# EAGLE design E19_mini (EAGLE 9.3.0)
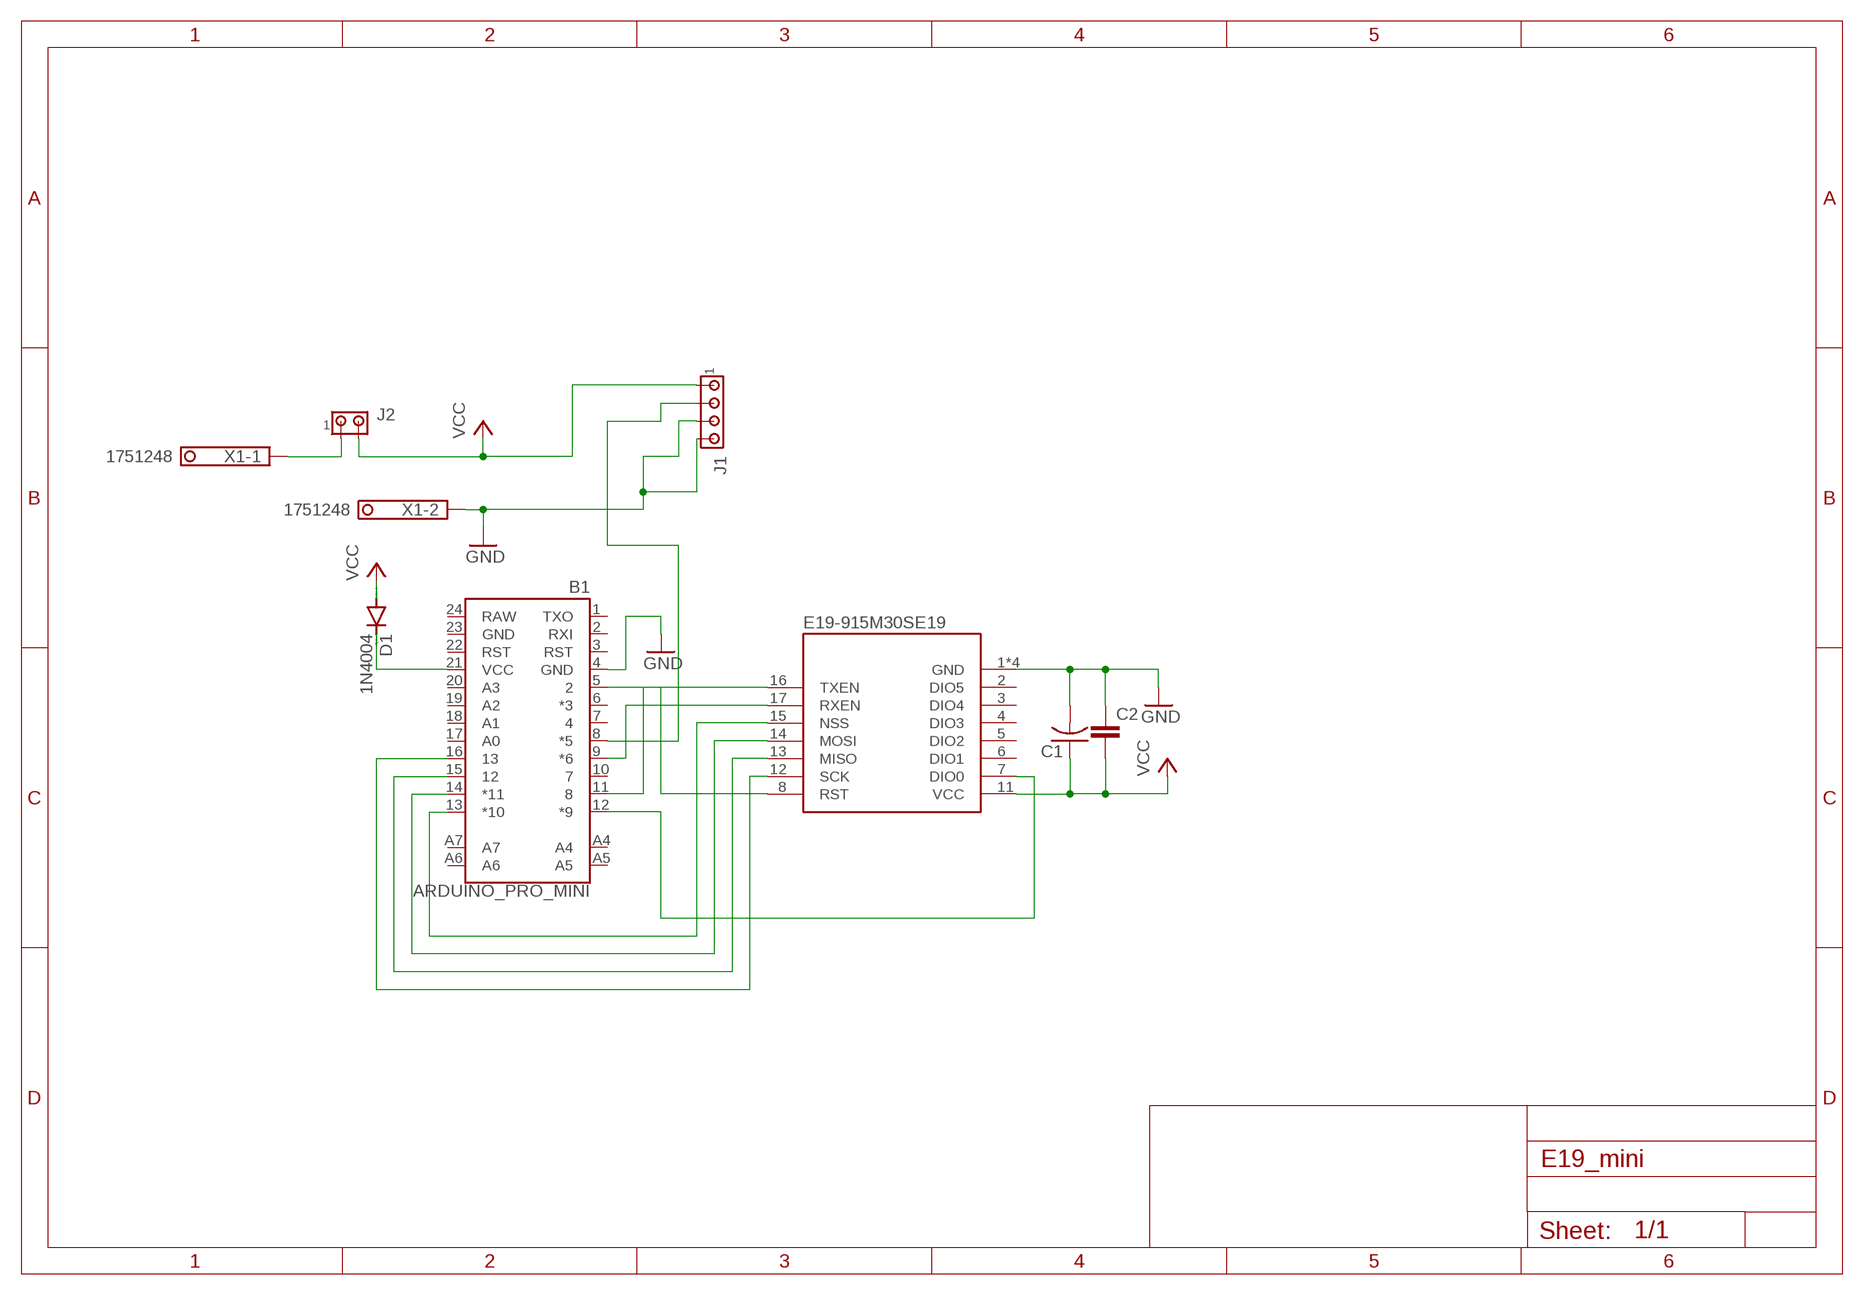
[diagram p0: schematic, sheet 1]

## Parts
B1  ARDUINO_PRO_MINI  [ARDUINO_PRO_MINI]
C1  C-US050-024X044  [C050-024X044]
C2  C-EU025-024X044  [C025-024X044]
D1  1N4004  [DO41-10]
J1  MTA04-100  [10X04MTA]
J2  MTA02-100  [10X02MTA]
U1  E19-915M30SE19  [DIP2540W53P254L2400H508Q18B]
X1  1751248  [1751248]

## Nets
GND: B1.4(GND) C1.2 C2.1 J1.3 J1.4 U1.1(GND) U1.9(GND) U1.10(GND) U1.18(GND) X1.2
N$1: B1.5 U1.8(RST)
N$2: B1.16 U1.12(SCK)
N$3: B1.15 U1.13(MISO)
N$4: B1.14(*11) U1.14(MOSI)
N$5: B1.13(*10) U1.15(NSS)
N$6: B1.11 U1.16(TXEN)
N$7: B1.9(*6) U1.17(RXEN)
N$8: B1.21(VCC) D1.C
N$9: J2.1 X1.1
N$10: B1.12(*9) U1.7(DIO0)
N$11: B1.8(*5) J1.2
VCC: C1.1 C2.2 D1.A J1.1 J2.2 U1.11(VCC)
Unconnected: B1.1(TXO) B1.2(RXI) B1.3(RST) B1.6(*3) B1.7 B1.10 B1.17(A0) B1.18(A1) B1.19(A2) B1.20(A3) B1.22(RST) B1.A4 B1.A5 B1.A6 B1.A7 U1.2(DIO5) U1.3(DIO4) U1.4(DIO3) U1.5(DIO2) U1.6(DIO1)

## Power pins joined to a net without a drawn wire
GND: B1.23(GND)
RAW: B1.24(RAW)

## Library data of the parts
B1 = ARDUINO_PRO_MINI:ARDUINO_PRO_MINI: SparkFun Pro Mini Pro Mini compatible footprint. Dimensions: 0.7 x 1.3" PCB Thickness: 0.8mm SparkFun Products: 3.3V/8MHz <https://www.sparkfun.com/products/11114> 5V/16MHz <https://www.sparkfun.com/products/11113>; AVAILABILITY: Unavailable; DESCRIPTION: ATmega328 Arduino Pro Mini 328 5V/16MHz AVR® ATmega AVR MCU 8-Bit Embedded Evaluation Board; MF: SparkFun Electronics; MP: ARDUINO PRO MINI; PACKAGE: Package Analog Devices; PRICE: None
C1 = rcl:C-US: CAPACITOR, American symbol; SPICEPREFIX: C
C2 = rcl:C-EU: CAPACITOR, European symbol; SPICEPREFIX: C
D1 = diode:1N4004: DIODE general purpose rectifier, 1 A
J1 = con-amp:MTA04-100: AMP connector
J2 = con-amp:MTA02-100: AMP connector
U1 = E22-900T30S:E19-915M30S: E22-900T30S is a wireless serial port module (UART) based on SEMTECH's SX1262 RF chip.
X1 = con-phoenix-350:1751248: MKDS 1/ 2-3,5 Printklemme Nennstrom: 10 A Bemessungsspannung: 160 V Raster: 3,5 mm Polzahl: 2 Montageart: Löten Anschlussart: Schraubanschluss Anschlussrichtung vom Leiter zur Platine: 0° Source: http://eshop.phoenixcontact.com .. 1751248.pdf; OC_FARNELL: unknown; OC_NEWARK: unknown

## Board
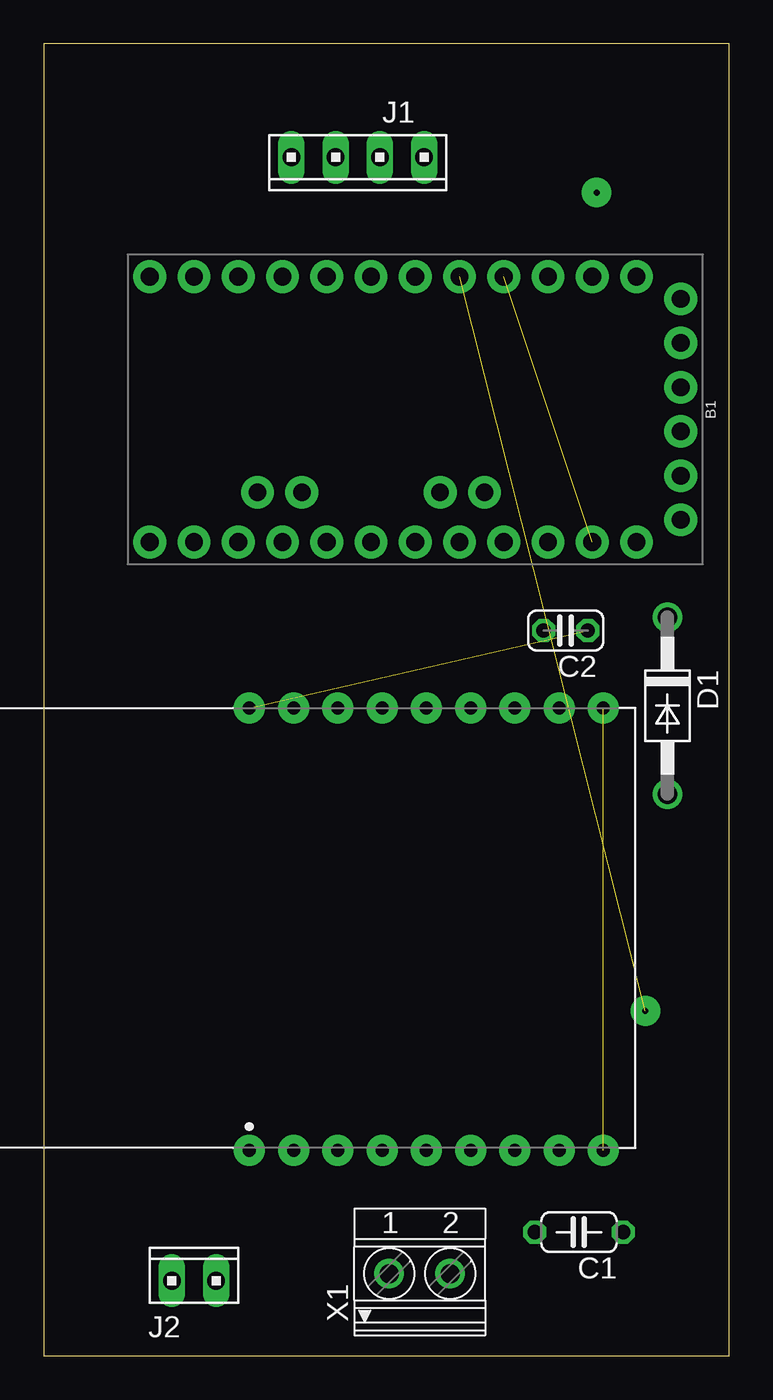
[diagram p1: board, top side]
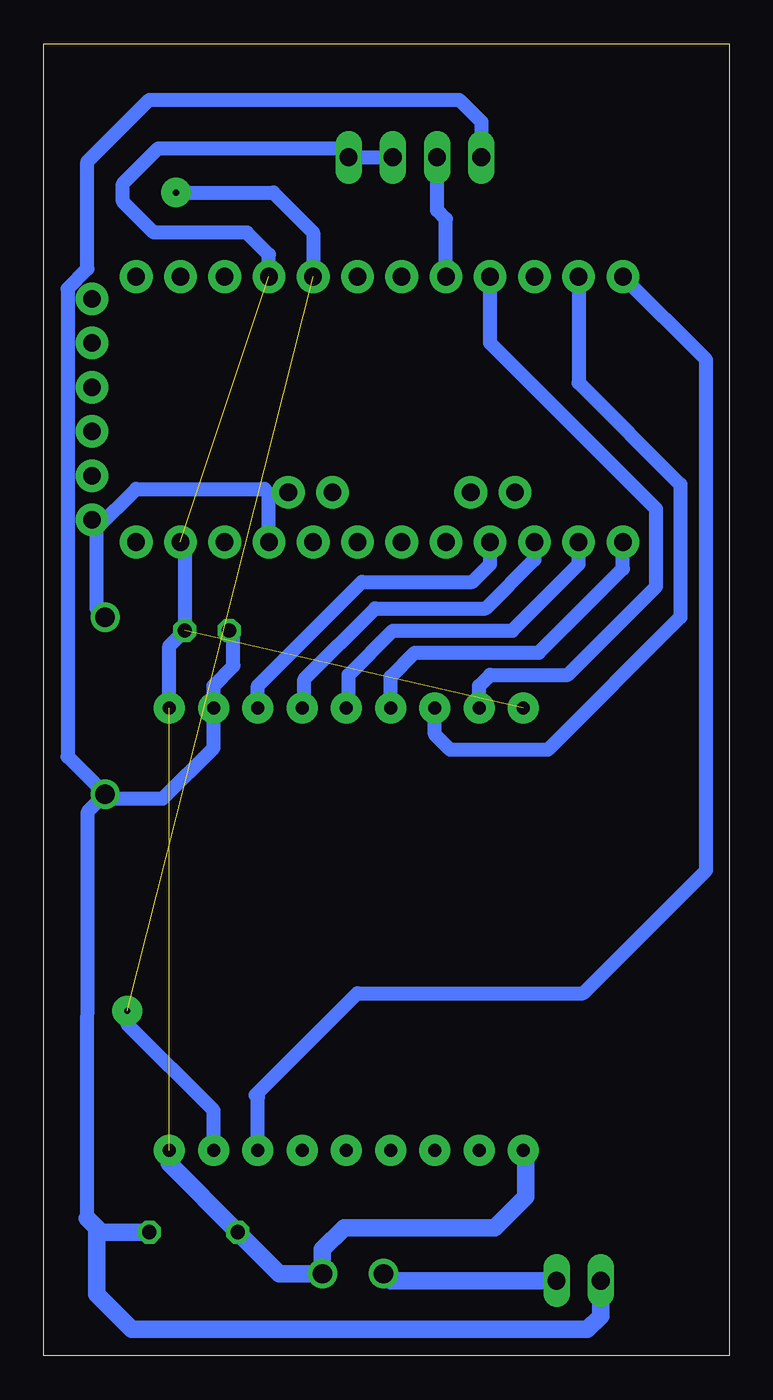
[diagram p2: board, bottom side, seen from below]

Size 39.35 x 75.36 mm. Coordinates in mm from the lower left corner, seen from the top.
Outline: 0,0 39.35,0 39.35,75.36 0,75.36 0,0
Copper layers (1*16): Top 0.035mm / dielectric 1.5mm / Bottom 0.035mm
Design rules "default": minimum track width 6mil, minimum drill 0.35mm, track to track 6mil, track to pad 6mil, pad to pad 6mil, via to via 6mil, smd to smd 6mil, copper to edge 40mil, drill to drill 6mil, minimum pad ring 10mil, minimum via ring 8mil, stop-mask expansion 4mil, vias tented up to drill 0mil, thermal gap 10mil

### Footprints (pad centres in the part's own frame; a part is rotated, then mirrored left to right if it is on the bottom)
ARDUINO_PRO_MINI = drill 1.016 pad 1.88: 1 -7.62,12.7; 2 -7.62,10.16; 3 -7.62,7.62; 4 -7.62,5.08; 5 -7.62,2.54; 6 -7.62,0; 7 -7.62,-2.54; 8 -7.62,-5.08; 9 -7.62,-7.62; 10 -7.62,-10.16; 11 -7.62,-12.7; 12 -7.62,-15.24; 13 7.62,-15.24; 14 7.62,-12.7; 15 7.62,-10.16; 16 7.62,-7.62; 17 7.62,-5.08; 18 7.62,-2.54; 19 7.62,0; 20 7.62,2.54; 21 7.62,5.08; 22 7.62,7.62; 23 7.62,10.16; 24 7.62,12.7; A4 4.763,1.429; A5 4.763,3.969; A6 4.763,-9.049; A7 4.763,-6.509; BLK -6.35,15.24; GND -3.81,15.24; GRN 6.35,15.24; RXI 1.27,15.24; TXO 3.81,15.24; VCC -1.27,15.24
C050-024X044 = drill 0.813 octagon: 1 -2.54,0; 2 2.54,0
C025-024X044 = drill 0.813 octagon: 1 -1.27,0; 2 1.27,0
DO41-10 = drill 1.118: A 5.08,0; C -5.08,0
10X04MTA = drill 1.016 long: 1 3.81,0; 2 1.27,0; 3 -1.27,0; 4 -3.81,0
10X02MTA = drill 1.016 long: 1 1.27,0; 2 -1.27,0
DIP2540W53P254L2400H508Q18B = drill 0.743 pad 1.778: 1 13.081,-9.779; 2 13.081,-7.239; 3 13.081,-4.699; 4 13.081,-2.159; 5 13.081,0.381; 6 13.081,2.921; 7 13.081,5.461; 8 13.081,8.001; 9 13.081,10.541; 10 -12.319,10.541; 11 -12.319,8.001; 12 -12.319,5.461; 13 -12.319,2.921; 14 -12.319,0.381; 15 -12.319,-2.159; 16 -12.319,-4.699; 17 -12.319,-7.239; 18 -12.319,-9.779
1751248 = drill 1.1 pad 1.7: 1 -1.75,-0.1; 2 1.75,-0.1

### Placement (x,y rotation side)
B1  21.34,54.36 270 top
C1  30.73,7.11 180 top
C2  29.97,41.66 180 top
D1  35.81,37.34 270 top
J1  18.03,68.83 180 top
J2  8.64,4.32 0 top
U1  21.59,24.89 270 top
X1  21.59,4.83 0 top

### Tracks (layer width: path | path; a pad name or v marks a point on that pad's centre or on a via)
GND  (3 unrouted)
  Bottom 0.813: U1.10 32.13,40.77 C2.1 31.24,46.48 B1.23 | B1.4 26.42,63.25 27.69,64.52 33.02,64.52 34.8,66.29 34.8,67.31 32.77,69.34 22.35,69.34 J1.4 J1.3
  Bottom 1.016: U1.9 32.13,11.05 C1.2 25.81,4.73 X1.2 23.34,6.12 22.1,7.37 13.46,7.37 11.68,9.14 11.68,11.68 U1.1
N$1  (via drill 0.35 pad 1.7)  (1 unrouted)
  Bottom 0.813: U1.8 29.59,14.1 34.54,19.05 v34.54,19.81 | 31.5,66.8 v31.75,66.8 26.16,66.8 23.88,64.52 B1.5
N$2
  Bottom 0.813: U1.12 27.05,38.48 21.08,44.45 14.73,44.45 13.72,45.47 B1.16
N$3
  Bottom 0.813: U1.13 24.38,37.34 24.38,38.86 20.32,42.93 13.97,42.93 11.18,45.72 B1.15
N$4
  Bottom 0.813: U1.14 21.84,37.34 21.84,39.12 19.3,41.66 12.45,41.66 8.64,45.47 B1.14
N$5
  Bottom 0.813: U1.15 19.43,38.99 18.03,40.39 10.92,40.39 6.1,45.21 B1.13
N$6
  Bottom 0.813: B1.11 8.64,55.88 2.79,50.04 2.79,42.42 10.41,34.8 16,34.8 16.89,35.69 U1.16
N$7
  Bottom 0.813: 14.35,37.97 U1.17 14.35,38.48 13.72,39.12 9.27,39.12 4.19,44.2 4.19,48.64 13.72,58.17 B1.9
N$8
  Bottom 0.813: D1.C 36.32,42.93 36.32,47.5 34.04,49.78 26.67,49.78 26.42,49.53 B1.21
N$9
  Bottom 1.016: X1.1 19.43,4.32 J2.1
N$10
  Bottom 0.61: 27.05,14.86 27.18,14.99
  Bottom 0.813: U1.7 27.05,14.86 | 27.18,14.99 21.34,20.83 8.38,20.83 1.32,27.89 1.32,57.2 B1.12
N$11
  Bottom 0.813: B1.8 16.26,65.28 16.76,65.79 J1.2
VCC
  Bottom 0.813: D1.A 36.81,31.26 36.83,7.89 | D1.A 35.56,32 32.51,32 29.59,34.92 U1.11 29.59,38.48 28.45,39.62 28.45,41.4 C2.2 | J1.1 14.22,70.87 15.49,72.14 33.27,72.14 36.83,68.58 36.83,62.43 37.97,61.28 37.97,34.42 D1.A
  Bottom 1.016: 36.3,7.37 36.3,3.54 34.29,1.52 8.13,1.52 7.37,2.29 J2.2 | C1.1 36.05,7.11 36.3,7.37 | 36.3,7.37 36.83,7.89